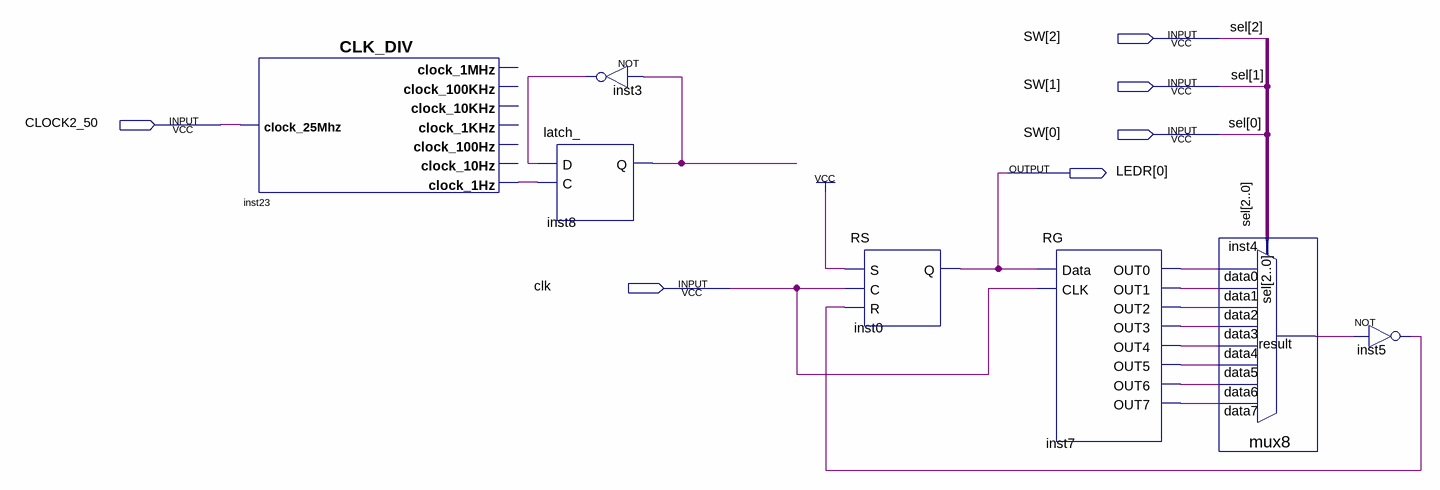
[diagram p0: schematic sheet]
// Quartus schematic Lab3_1.bdf as structural Verilog: 7 symbols, 6 pins
module Lab3_1 (
  input  [2:0] SW,
  input  CLOCK2_50,
  input  clk,
  output [0:0] LEDR
);

  wire inst3_out, inst4_result, inst5_out, inst7_out0, inst7_out1, inst7_out2, inst7_out3, inst7_out4,
       inst7_out5, inst7_out6, inst7_out7, inst8_q, inst23_clock_1hz;

  CLK_DIV inst23 (
    .clock_25Mhz(CLOCK2_50), .clock_1Hz(inst23_clock_1hz));  // open: clock_1MHz, clock_100KHz, clock_10KHz, clock_1KHz, clock_100Hz, clock_10Hz
  latch_ inst8 (.D(inst3_out), .C(inst23_clock_1hz), .Q(inst8_q));
  not inst3 (inst3_out, inst8_q);
  RS inst0 (.S(1'b1), .C(clk), .R(inst5_out), .Q(LEDR[0]));
  RG inst7 (
    .Data(LEDR[0]), .CLK(clk), .OUT0(inst7_out0), .OUT1(inst7_out1), .OUT2(inst7_out2), .OUT3(inst7_out3),
    .OUT4(inst7_out4), .OUT5(inst7_out5), .OUT6(inst7_out6), .OUT7(inst7_out7));
  mux8 inst4 (
    .data7(inst7_out7), .data6(inst7_out6), .data5(inst7_out5), .data4(inst7_out4), .data3(inst7_out3),
    .data2(inst7_out2), .data1(inst7_out1), .data0(inst7_out0), .sel(SW), .result(inst4_result));
  not inst5 (inst5_out, inst4_result);

  // Other names for the same wires on the sheet: sel[2:0] = SW
endmodule
